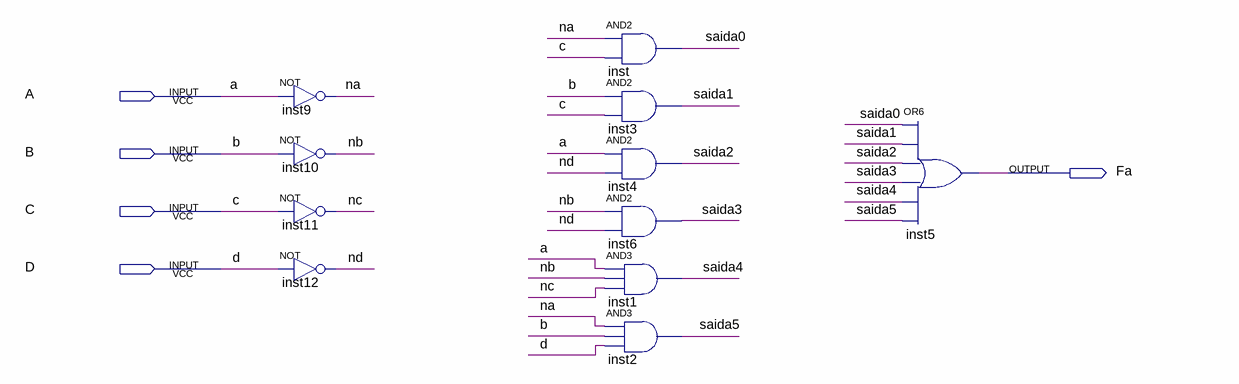
[diagram p0: schematic sheet]
// Quartus schematic FuncaoA.bdf as structural Verilog: 11 symbols, 5 pins
module FuncaoA (
  input  A,
  input  B,
  input  C,
  input  D,
  output Fa
);

  wire na, nb, nc, nd, saida0, saida1, saida2, saida3, saida4, saida5;

  not inst9 (na, A);
  not inst10 (nb, B);
  not inst11 (nc, C);
  not inst12 (nd, D);
  and inst (saida0, na, C);
  and inst3 (saida1, B, C);
  and inst4 (saida2, A, nd);
  and inst6 (saida3, nb, nd);
  and inst1 (saida4, A, nb, nc);
  and inst2 (saida5, na, B, D);
  or inst5 (Fa, saida0, saida1, saida2, saida3, saida4, saida5);
endmodule
